# Altium schematic sheet bms_slave.SchDoc: bms_slave
size 580 x 453 mm; Date: 22/08/2017 2:36:35 p.m.; SheetNumber: 1
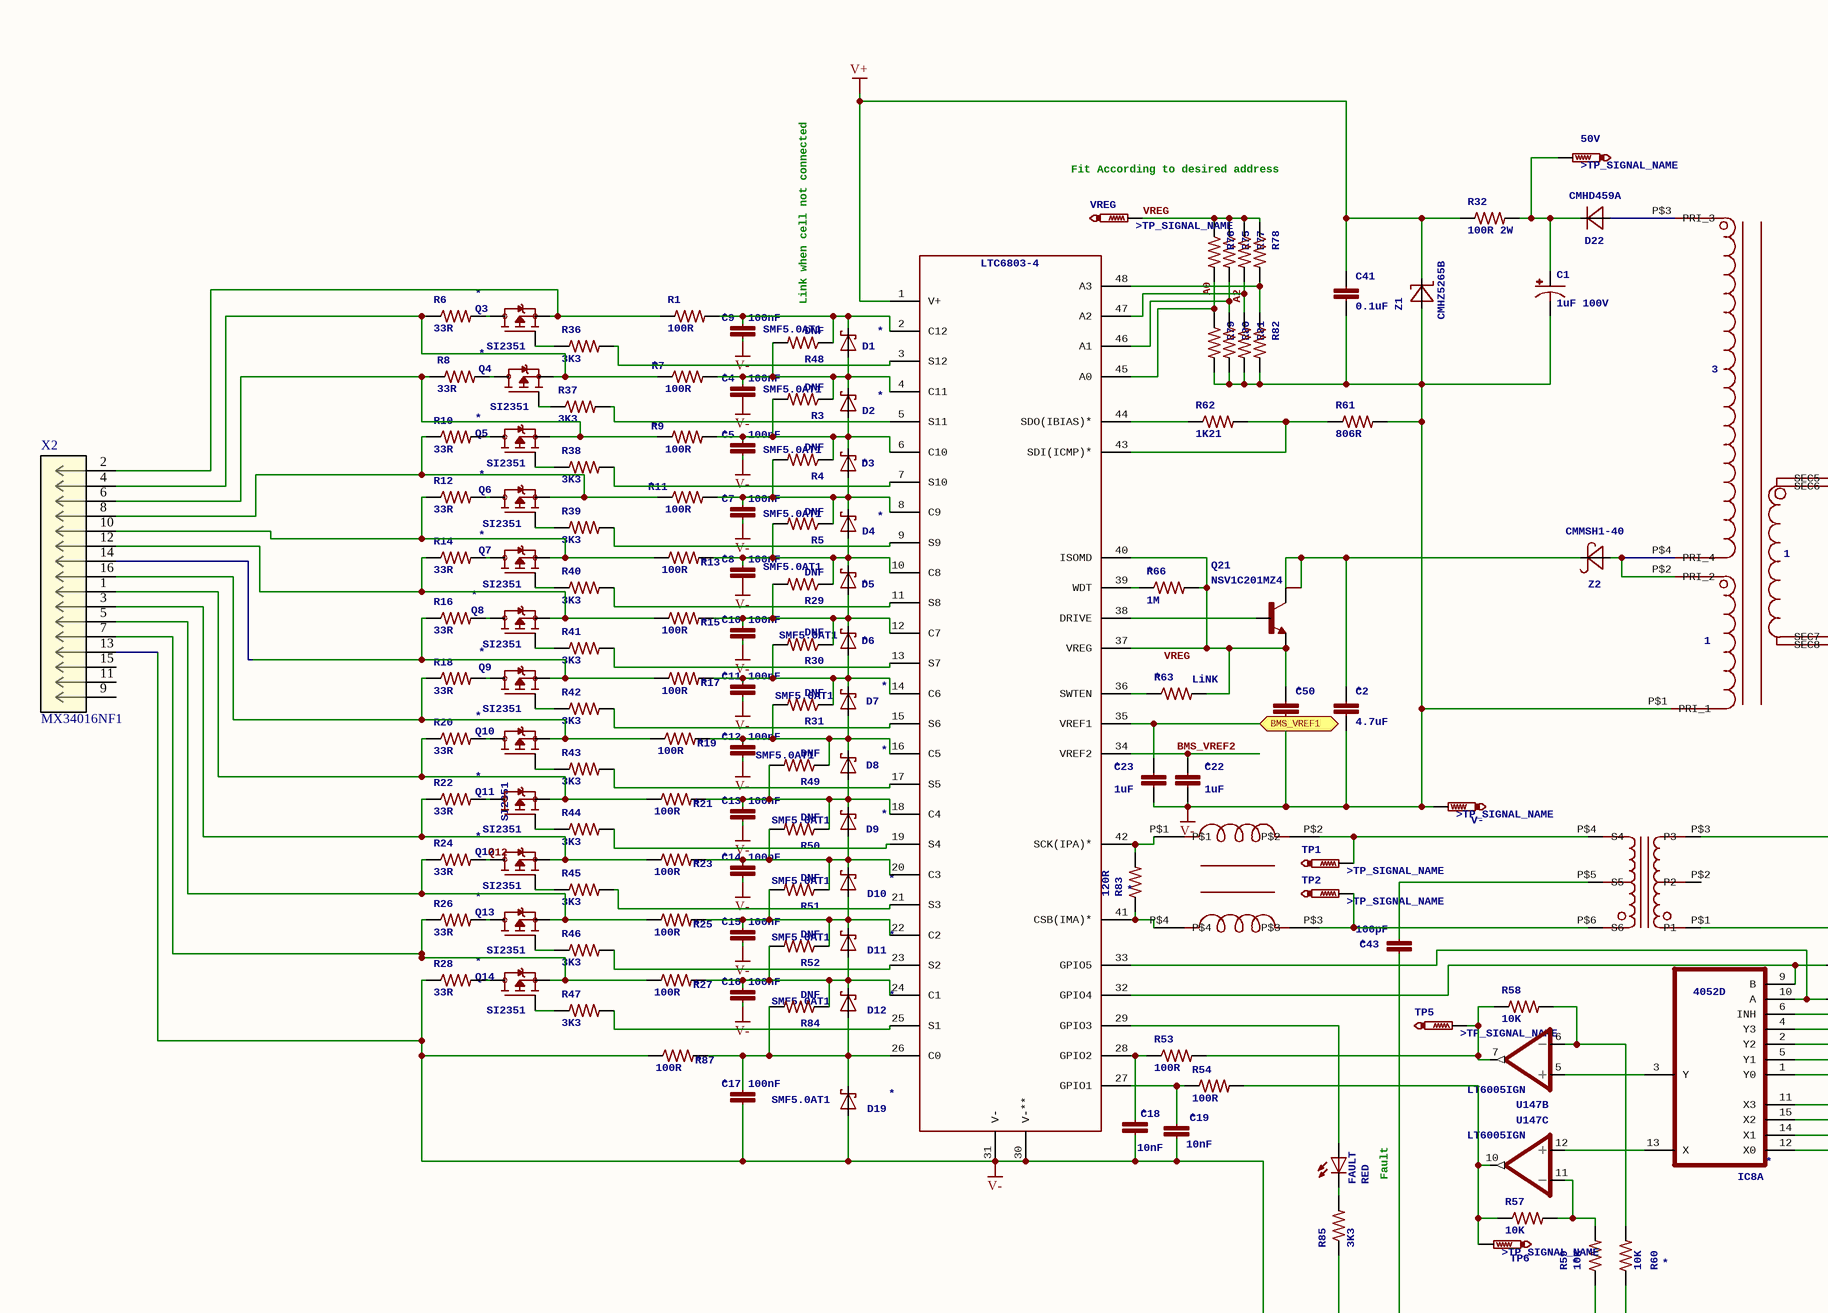
[diagram p0: bms_slave.SchDoc, top left]
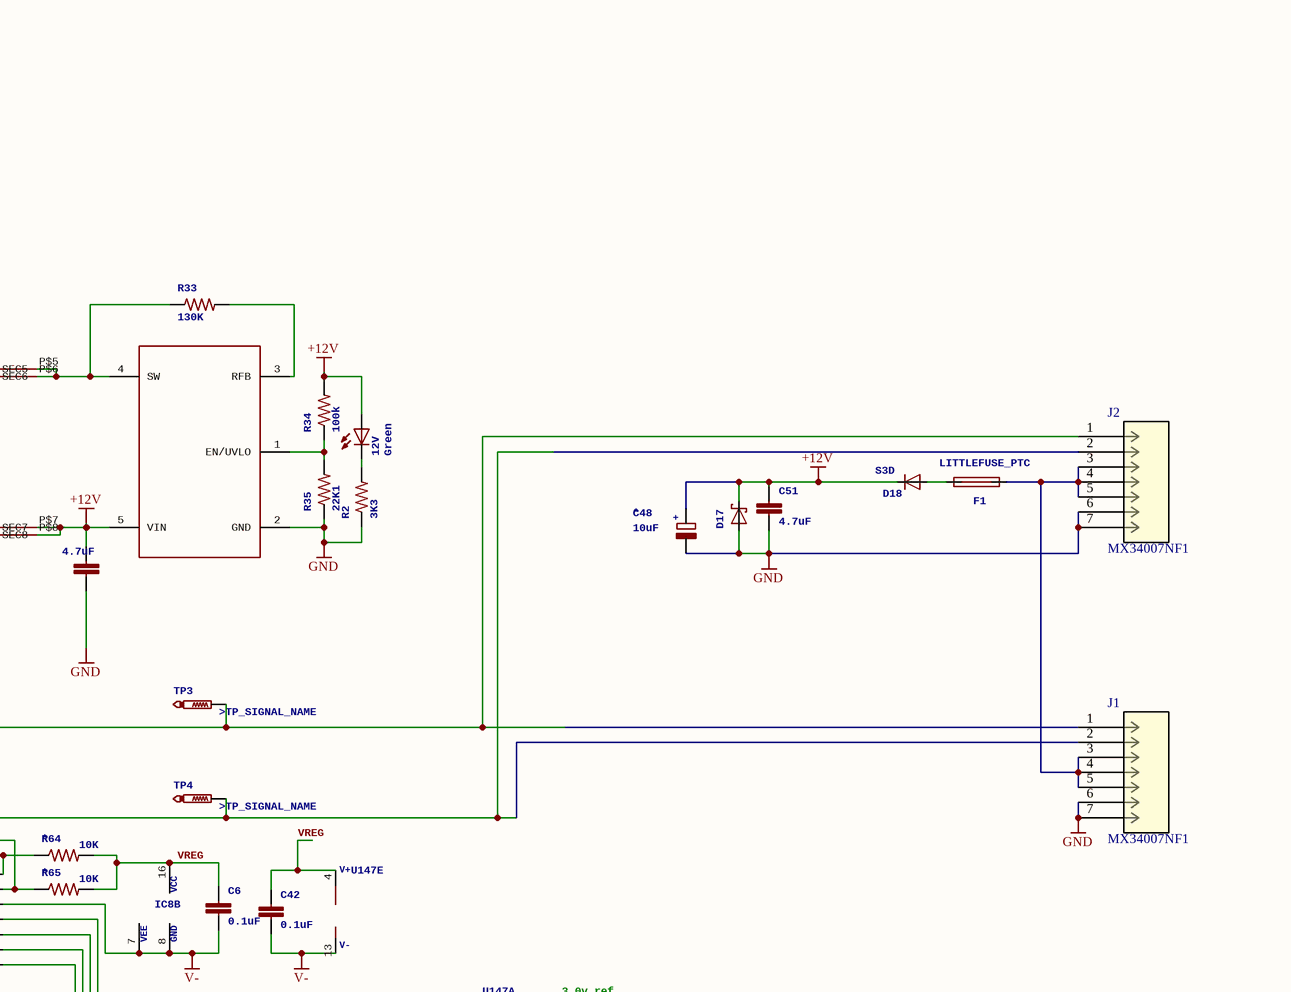
[diagram p1: bms_slave.SchDoc, top right]
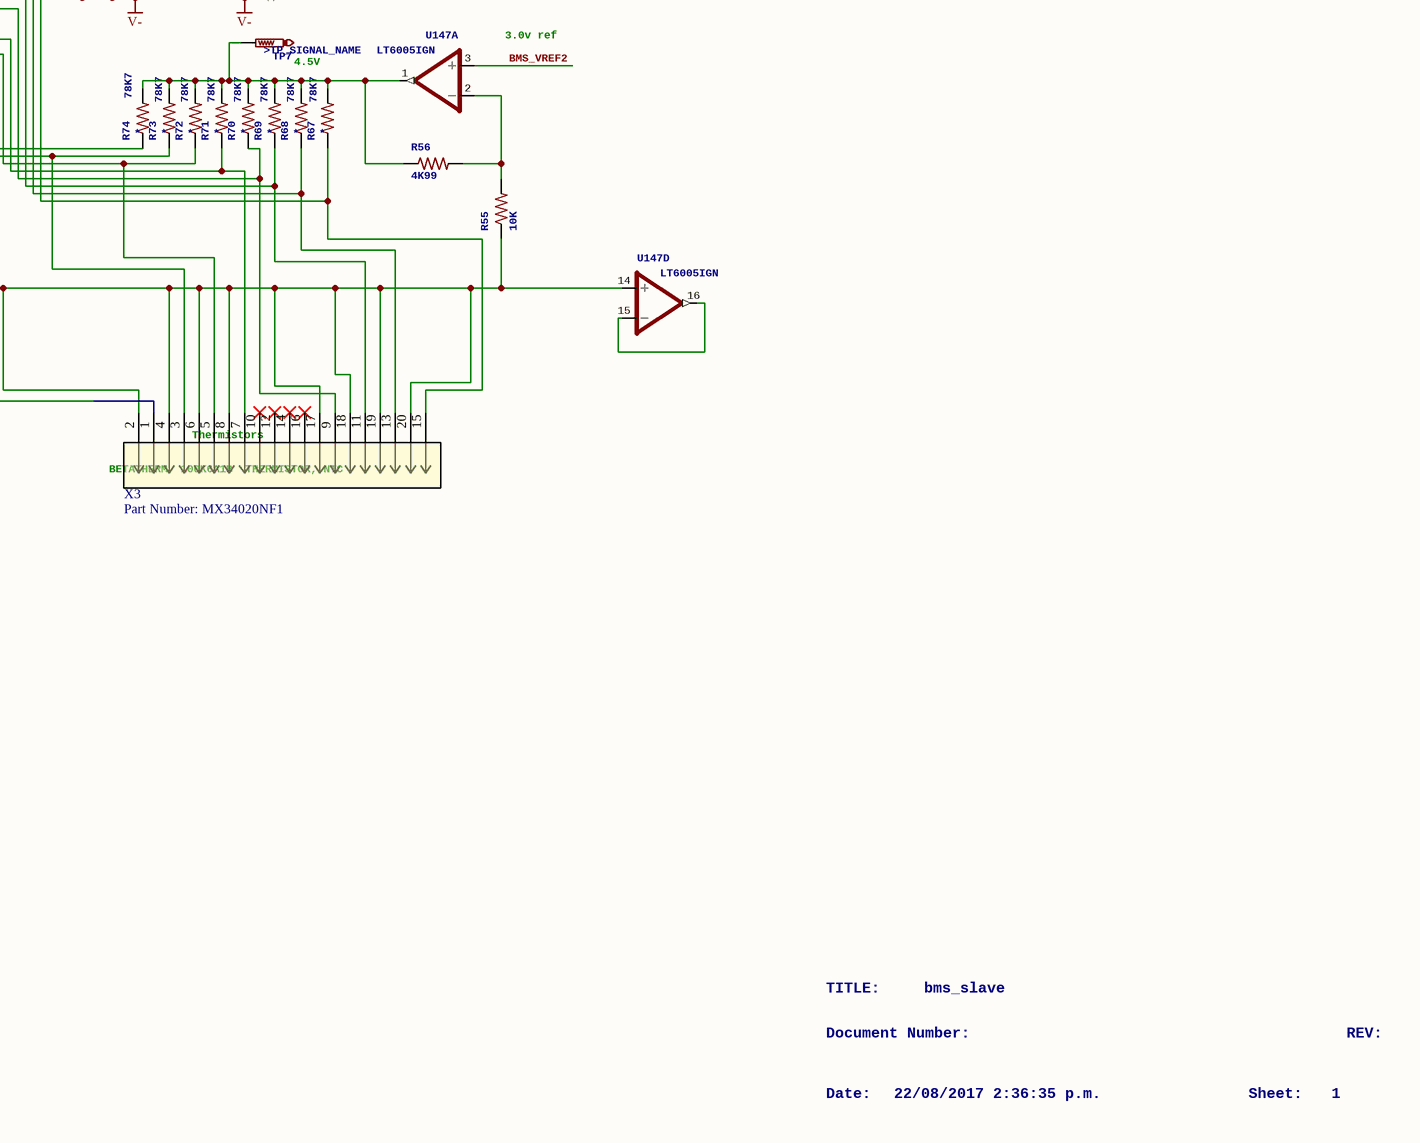
[diagram p2: bms_slave.SchDoc, bottom right]

## Parts
12V  Green  [CHIP-LED0805]
50V  TP_SIGNAL_NAME: >TP_SIGNAL_NAME  [P1-13]  (hidden comment: PTR1PAD1-13)
C1  1uF 100V  [SMC_D]
C2  4.7uF  [C1206]
C3  4.7uF  [C1206]
C4  100nF  [C0603@1]
C5  100nF  [C0603@1]
C6  0.1uF  [C1206]
C7  100nF  [C0603@1]
C8  100nF  [C0603@1]
C9  100nF  [C0603@1]
C10  100nF  [C0603@1]
C11  100nF  [C0603@1]
C12  100nF  [C0603@1]
C13  100nF  [C0603@1]
C14  100nF  [C0603@1]
C15  100nF  [C0603@1]
C16  100nF  [C0603@1]
C17  100nF  [C0603@1]
C18  10nF  [C0603@1]
C19  10nF  [C0603@1]
C22  1uF  [C1206]
C23  1uF  [C1206]
C41  0.1uF  [C1206]
C42  0.1uF  [C1206]
C43  100pF  [C1206@1]
C48  10uF  [SMC_D]
C50  1uF  [C1206]
C51  4.7uF  [C1206]
D1  SMF5.0AT1  [SOD123FL]
D2  SMF5.0AT1  [SOD123FL]
D3  SMF5.0AT1  [SOD123FL]
D4  SMF5.0AT1  [SOD123FL]
D5  SMF5.0AT1  [SOD123FL]
D6  SMF5.0AT1  [SOD123FL]
D7  SMF5.0AT1  [SOD123FL]
D8  SMF5.0AT1  [SOD123FL]
D9  SMF5.0AT1  [SOD123FL]
D10  SMF5.0AT1  [SOD123FL]
D11  SMF5.0AT1  [SOD123FL]
D12  SMF5.0AT1  [SOD123FL]
D17  SCHOTTKY-DIODESMC  [SMC]  (value not drawn)
D18  S3D  [SMC]
D19  SMF5.0AT1  [SOD123FL]
D22  CMHD459A  [SOD123]
F1  LITTLEFUSE_PTC  [1812]
FAULT  RED  [CHIP-LED0805]
IC8  4052D  [SO16]  (parts A,B of 2)
J1  MX34007NF1  [CONN_MX34007NF1]
J2  MX34007NF1  [CONN_MX34007NF1]
Q3  SI2351  [SOT23]
Q4  SI2351  [SOT23]
Q5  SI2351  [SOT23]
Q6  SI2351  [SOT23]
Q7  SI2351  [SOT23]
Q8  SI2351  [SOT23]
Q9  SI2351  [SOT23]
Q10  SI2351  [SOT23]
Q11  SI2351  [SOT23]
Q12  SI2351  [SOT23]
Q13  SI2351  [SOT23]
Q14  SI2351  [SOT23]
Q21  NSV1C201MZ4  [SOT223]
R1  100R  [R0603]
R2  3K3  [R0603]
R3  DNF  [R0603]
R4  DNF  [R0603]
R5  DNF  [R0603]
R6  33R  [R2512]
R7  100R  [R0603]
R8  33R  [R2512]
R9  100R  [R0603]
R10  33R  [R2512]
R11  100R  [R0603]
R12  33R  [R2512]
R13  100R  [R0603]
R14  33R  [R2512]
R15  100R  [R0603]
R16  33R  [R2512]
R17  100R  [R0603]
R18  33R  [R2512]
R19  100R  [R0603]
R20  33R  [R2512]
R21  100R  [R0603]
R22  33R  [R2512]
R23  100R  [R0603]
R24  33R  [R2512]
R25  100R  [R0603]
R26  33R  [R2512]
R27  100R  [R0603]
R28  33R  [R2512]
R29  DNF  [R0603]
R30  DNF  [R0603]
R31  DNF  [R0603]
R32  100R 2W  [R2512]
R33  130K  [R0603]
R34  100k  [R0603]
R35  22K1  [R0603]
R36  3K3  [R0603]
R37  3K3  [R0603]
R38  3K3  [R0603]
R39  3K3  [R0603]
R40  3K3  [R0603]
R41  3K3  [R0603]
R42  3K3  [R0603]
R43  3K3  [R0603]
R44  3K3  [R0603]
R45  3K3  [R0603]
R46  3K3  [R0603]
R47  3K3  [R0603]
R48  DNF  [R0603]
R49  DNF  [R0603]
R50  DNF  [R0603]
R51  DNF  [R0603]
R52  DNF  [R0603]
R53  100R  [R0603]
R54  100R  [R0603]
R55  10K  [R0603]
R56  4K99  [R0603]
R57  10K  [R0603]
R58  10K  [R0603]
R59  10K  [R0603]
R60  10K  [R0603]
R61  806R  [R0603]
R62  1K21  [R0603]
R63  LiNK  [R0603]
R64  10K  [R0603]
R65  10K  [R0603]
R66  1M  [R0603]
R67  78K7  [R0603]
R68  78K7  [R0603]
R69  78K7  [R0603]
R70  78K7  [R0603]
R71  78K7  [R0603]
R72  78K7  [R0603]
R73  78K7  [R0603]
R74  78K7  [R0603]
R75  R-US_R0603  [R0603]  (value not drawn)
R76  R-US_R0603  [R0603]  (value not drawn)
R77  R-US_R0603  [R0603]  (value not drawn)
R78  R-US_R0603  [R0603]  (value not drawn)
R79  R-US_R0603  [R0603]  (value not drawn)
R80  R-US_R0603  [R0603]  (value not drawn)
R81  R-US_R0603  [R0603]  (value not drawn)
R82  R-US_R0603  [R0603]  (value not drawn)
R83  120R  [R0603]
R84  DNF  [R0603]
R85  3K3  [R0603]
R87  100R  [R0603]
TP1  TP_SIGNAL_NAME: >TP_SIGNAL_NAME  [P1-13]  (hidden comment: PTR1PAD1-13)
TP2  TP_SIGNAL_NAME: >TP_SIGNAL_NAME  [P1-13]  (hidden comment: PTR1PAD1-13)
TP3  TP_SIGNAL_NAME: >TP_SIGNAL_NAME  [P1-13]  (hidden comment: PTR1PAD1-13)
TP4  TP_SIGNAL_NAME: >TP_SIGNAL_NAME  [P1-13]  (hidden comment: PTR1PAD1-13)
TP5  TP_SIGNAL_NAME: >TP_SIGNAL_NAME  [P1-13]  (hidden comment: PTR1PAD1-13)
TP6  TP_SIGNAL_NAME: >TP_SIGNAL_NAME  [P1-13]  (hidden comment: PTR1PAD1-13)
TP7  TP_SIGNAL_NAME: >TP_SIGNAL_NAME  [P1-13]  (hidden comment: PTR1PAD1-13)
U1  LTC6804-2  [SSOP48]  (value not drawn)
U21  LT8300  [TSOT23-5]  (value not drawn)
U147  LT6005IGN  [TSSOP16]  (parts A,B,C,D,E of 7)
U$1  DLW43SH510XK2  [DLW43S]  (value not drawn)
U$3  T3001NL  [T3001NL]  (value not drawn)
U$15  WURTH_750370040  [WE_750370040]  (value not drawn)
V-  TP_SIGNAL_NAME: >TP_SIGNAL_NAME  [P1-13]  (hidden comment: PTR1PAD1-13)
VREG  TP_SIGNAL_NAME: >TP_SIGNAL_NAME  [P1-13]  (hidden comment: PTR1PAD1-13)
X2  MX34016NF1
X3  Part Number: MX34020NF1  [CONN_MX34020NF1]
Z1  CMHZ5265B  [SOD123]
Z2  CMMSH1-40  [SOD123]

## Ports
BMS_VREF1

## Nets
+12V: 12V.A C3.1 C48.+ C51.1 D17.C D18.C R34.2 U21.5(VIN) U$15.P$7(SEC7) U$15.P$8(SEC8)
GND: C3.2 C48.- C51.2 D17.A J1.6 J1.7 J2.6 J2.7 R2.1 R35.1 U21.2(GND)
V+: C41.1 R32.1 U1.1(V+) Z1.C
V-: C1.- C2.2 C4.2 C5.2 C6.2 C7.2 C8.2 C9.2 C10.2 C11.2 C12.2 C13.2 C14.2 C15.2 C16.2 C17.2 C18.2 C19.2 C22.2 C23.2 C41.2 C42.2 C43.2 C50.2 D19.A IC8.6(INH) IC8.7(VEE) IC8.8(GND) R28.1 R55.1 R59.1 R60.1 R61.2 R79.2 R80.2 R81.2 R82.2 R85.1 R87.1 U1.30(V-**) U1.31(V-) U147.13(V-) U147.14(+IN) U$15.P$1(PRI_1) V-.TP X2.13 X3.2 X3.4 X3.6 X3.8 X3.17 X3.18 X3.19 X3.20 Z1.A
A0: R76.2 R79.1 U1.45(A0)
A2: R77.2 R81.1 U1.47(A2)
BMS_VREF1: C23.1 U1.35(VREF1) ; port BMS_VREF1
BMS_VREF2: C22.1 U1.34(VREF2) U147.3(+IN)
Q12: Q12.3(D) R24.2
VREG: C6.1 C42.1 C50.1 IC8.16(VCC) Q21.3(E) R63.2 R64.2 R65.2 R66.2 R75.1 R76.1 R77.1 R78.1 U1.37(VREG) U1.40(ISOMD) U147.4(V+) VREG.TP
Net12V_C: 12V.C R2.2
Net50V_TP: 50V.TP C1.+ D22.C R32.2
NetC2_1: C2.1 Q21.2(C2) Q21.4(C4) Z2.C
NetC4_1: C4.1 D1.A D2.C R3.1 R7.2 R48.2 U1.4(C11)
NetC5_1: C5.1 D2.A D3.C R3.2 R4.1 R9.2 U1.6(C10)
NetC7_1: C7.1 D3.A D4.C R4.2 R5.1 R11.2 U1.8(C9)
NetC8_1: C8.1 D4.A D5.C R5.2 R13.2 R29.1 U1.10(C8)
NetC9_1: C9.1 D1.C R1.2 R48.1 U1.2(C12)
NetC10_1: C10.1 D5.A D6.C R15.2 R29.2 R30.1 U1.12(C7)
NetC11_1: C11.1 D6.A D7.C R17.2 R30.2 R31.1 U1.14(C6)
NetC12_1: C12.1 D7.A D8.C R19.2 R31.2 R49.1 U1.16(C5)
NetC13_1: C13.1 D8.A D9.C R21.2 R49.2 R50.1 U1.18(C4)
NetC14_1: C14.1 D9.A D10.C R23.2 R50.2 R51.1 U1.20(C3)
NetC15_1: C15.1 D10.A D11.C R25.2 R51.2 R52.1 U1.22(C2)
NetC16_1: C16.1 D11.A D12.C R27.2 R52.2 R84.1 U1.24(C1)
NetC17_1: C17.1 D12.A D19.C R84.2 R87.2 U1.26(C0)
NetC18_1: C18.1 R53.1 U1.28(GPIO2)
NetC19_1: C19.1 R54.1 U1.27(GPIO1)
NetC43_1: C43.1 U$3.P$5(S5)
NetD18_A: D18.A F1.P$2
NetD22_A: D22.A U$15.P$3(PRI_3)
NetF1_P$1: F1.P$1 J1.3 J1.4 J1.5 J2.3 J2.4 J2.5
NetFAULT_A: FAULT.A U1.29(GPIO3)
NetFAULT_C: FAULT.C R85.2
NetIC8_1: IC8.1(Y0) R70.1 X3.9
NetIC8_2: IC8.2(Y2) R68.1 X3.13
NetIC8_3: IC8.3(Y) U147.5(+IN)
NetIC8_4: IC8.4(Y3) R67.1 X3.15
NetIC8_5: IC8.5(Y1) R69.1 X3.11
NetIC8_9: IC8.9(B) R64.1 U1.32(GPIO4)
NetIC8_10: IC8.10(A) R65.1 U1.33(GPIO5)
NetIC8_11: IC8.11(X3) R71.1 X3.7
NetIC8_12: IC8.12(X0) R74.1 X3.1
NetIC8_13: IC8.13(X) U147.12(+IN)
NetIC8_14: IC8.14(X1) R73.1 X3.3
NetIC8_15: IC8.15(X2) R72.1 X3.5
NetJ1_1: J1.1 J2.1 TP3.TP U$3.P$3(P3)
NetJ1_2: J1.2 J2.2 TP4.TP U$3.P$1(P1)
NetQ3_1: Q3.1(G) R36.1
NetQ3_2: Q3.2(S) R1.1 X2.2
NetQ3_3: Q3.3(D) R6.2
NetQ4_1: Q4.1(G) R37.1
NetQ4_2: Q4.2(S) R6.1 R7.1 X2.4
NetQ4_3: Q4.3(D) R8.2
NetQ5_1: Q5.1(G) R38.1
NetQ5_2: Q5.2(S) R8.1 R9.1 X2.6
NetQ5_3: Q5.3(D) R10.2
NetQ6_1: Q6.1(G) R39.1
NetQ6_2: Q6.2(S) R10.1 R11.1 X2.8
NetQ6_3: Q6.3(D) R12.2
NetQ7_1: Q7.1(G) R40.1
NetQ7_2: Q7.2(S) R12.1 R13.1 X2.10
NetQ7_3: Q7.3(D) R14.2
NetQ8_1: Q8.1(G) R41.1
NetQ8_2: Q8.2(S) R14.1 R15.1 X2.12
NetQ8_3: Q8.3(D) R16.2
NetQ9_1: Q9.1(G) R42.1
NetQ9_2: Q9.2(S) R16.1 R17.1 X2.14
NetQ9_3: Q9.3(D) R18.2
NetQ10_1: Q10.1(G) R43.1
NetQ10_2: Q10.2(S) R18.1 R19.1 X2.16
NetQ10_3: Q10.3(D) R20.2
NetQ11_1: Q11.1(G) R44.1
NetQ11_2: Q11.2(S) R20.1 R21.1 X2.1
NetQ11_3: Q11.3(D) R22.2
NetQ12_1: Q12.1(G) R45.1
NetQ12_2: Q12.2(S) R22.1 R23.1 X2.3
NetQ13_1: Q13.1(G) R46.1
NetQ13_2: Q13.2(S) R24.1 R25.1 X2.5
NetQ13_3: Q13.3(D) R26.2
NetQ14_1: Q14.1(G) R47.1
NetQ14_2: Q14.2(S) R26.1 R27.1 X2.7
NetQ14_3: Q14.3(D) R28.2
NetQ21_1: Q21.1(B) U1.38(DRIVE)
NetR33_1: R33.1 U21.4(SW) U$15.P$5(SEC5) U$15.P$6(SEC6)
NetR33_2: R33.2 U21.3(RFB)
NetR34_1: R34.1 R35.2 U21.1(EN/UVLO)
NetR36_2: R36.2 U1.3(S12)
NetR37_2: R37.2 U1.5(S11)
NetR38_2: R38.2 U1.7(S10)
NetR39_2: R39.2 U1.9(S9)
NetR40_2: R40.2 U1.11(S8)
NetR41_2: R41.2 U1.13(S7)
NetR42_2: R42.2 U1.15(S6)
NetR43_2: R43.2 U1.17(S5)
NetR44_2: R44.2 U1.19(S4)
NetR45_2: R45.2 U1.21(S3)
NetR46_2: R46.2 U1.23(S2)
NetR47_2: R47.2 U1.25(S1)
NetR53_2: R53.2 R58.1 TP5.TP U147.7(OUT)
NetR54_2: R54.2 R57.1 TP6.TP U147.10(OUT)
NetR55_2: R55.2 R56.2 U147.2(-IN)
NetR56_1: R56.1 R67.2 R68.2 R69.2 R70.2 R71.2 R72.2 R73.2 R74.2 TP7.TP U147.1(OUT)
NetR57_2: R57.2 R59.2 U147.11(-IN)
NetR58_2: R58.2 R60.2 U147.6(-IN)
NetR61_1: R61.1 R62.2 U1.43(SDI(ICMP)*)
NetR62_1: R62.1 U1.44(SDO(IBIAS)*)
NetR63_1: R63.1 U1.36(SWTEN)
NetR66_1: R66.1 U1.39(WDT)
NetR75_2: R75.2 R80.1 U1.46(A1)
NetR78_2: R78.2 R82.1 U1.48(A3)
NetR83_1: R83.1 U1.41(CSB(IMA)*) U$1.P$4
NetR83_2: R83.2 U1.42(SCK(IPA)*) U$1.P$1
NetTP1_TP: TP1.TP U$1.P$2 U$3.P$4(S4)
NetTP2_TP: TP2.TP U$1.P$3 U$3.P$6(S6)
NetU147_15: U147.15(-IN) U147.16(OUT)
NetU$15_P$2: U$15.P$2(PRI_2) U$15.P$4(PRI_4) Z2.A

Not connected (* = marked no-connect by the designer): U$3 P$2(P2); X2 9 11 15; X3 10* 12* 14* 16*

## Notes on the sheet
- Fit According to desired address
- Link when cell not connected
- (near U147) 3.0v ref
- Fault
- 4.5V
- (near X3) BETATHERM  100K6A1B  THERMISTOR, NTC
- (near X3) Thermistors
- TITLE:
- Document Number:
- bms_slave
- REV:
- Date:
- 22/08/2017 2:36:35 p.m.
- Sheet:
- 1
- 2
- 3
- 4
- 5
- 6
- 7
- 8
- 9
- 10
- 11
- A
- B
- C
- D
- E
- F
- G
- H
- I

## Library data of the parts
12V FAULT = LEDCHIP-LED0805: LED   OSRAM: - CHIPLED LG R971, LG N971, LY N971, LG Q971, LY Q971, LO R971, LY R971 LH N974, LH R974 LS Q976, LO Q976, LY Q976 LO Q996 - Hyper CHIPLED LW Q18S LB Q993, LB Q99A, LB R99A - SideLED LS A670, LO A670, LY A670, LG A670, LP A670 LB A673, LV A673, LT A673, LW A673 LH A674 LY A675 LS A676, LA A676, LO A676, LY A676, LW A676 LS A679, LY A679, LG A679 -  Hyper Micro SIDELEDÂ® LS Y876, LA Y876, LO Y876, LY Y876 LT Y87S - SmartLED LW L88C, LW L88S LB L89C, LB L89S, LG L890 LS L89K, LO L89K, LY L89K LS L896, LA L896, LO L896, LY L896 - TOPLED LS T670, LO T670, LY T670, LG T670, LP T670 LSG T670, LSP T670, LSY T670, LOP T670, LYG T670 LG T671, LOG T671, LSG T671 LB T673, LV T673, LT T673, LW T673 LH T674 LS T676, LA T676, LO T676, LY T676, LB T676, LH T676, LSB T676, LW T676 LB T67C, LV T67C, LT T67C, LS T67K, LO T67K, LY T67K, LW E67C LS E67B, LA E67B, LO E67B, LY E67B, LB E67C, LV E67C, LT E67C LW T67C LS T679, LY T679, LG T679 LS T770, LO T770, LY T770, LG T770, LP T770 LB T773, LV T773, LT T773, LW T773 LH T774 LS E675, LA E675, LY E675, LS T675 LS T776, LA T776, LO T776, LY T776, LB T776 LHGB T686 LT T68C, LB T68C - Hyper Mini TOPLEDÂ® LB M676 - Mini TOPLED SantanaÂ® LG M470 LS M47K, LO M47K, LY M47K    Source: http://www.osram.convergy.de   LUXEON: - LUMILEDÂ® LXK2-PW12-R00, LXK2-PW12-S00, LXK2-PW14-U00, LXK2-PW14-V00 LXK2-PM12-R00, LXK2-PM12-S00, LXK2-PM14-U00 LXK2-PE12-Q00, LXK2-PE12-R00, LXK2-PE12-S00, LXK2-PE14-T00, LXK2-PE14-U00 LXK2-PB12-K00, LXK2-PB12-L00, LXK2-PB12-M00, LXK2-PB14-N00, LXK2-PB14-P00, LXK2-PB14-Q00 LXK2-PR12-L00, LXK2-PR12-M00, LXK2-PR14-Q00, LXK2-PR14-R00 LXK2-PD12-Q00, LXK2-PD12-R00, LXK2-PD12-S00 LXK2-PH12-R00, LXK2-PH12-S00 LXK2-PL12-P00, LXK2-PL12-Q00, LXK2-PL12-R00    Source: www.luxeon.com   KINGBRIGHT:   KA-3528ASYC Source: www.kingbright.com
50V TP1-TP7 V- VREG = PTR1PAD1-13: TEST PIN
C1 = CPOL-USSMCD: POLARIZED CAPACITOR, American symbol
C2 C3 C6 C22 C23 C41 C42 C50 C51 = C-EUC1206: CAPACITOR, European symbol
  C2 C22 C23 C50: NAME: *
C4 C5 C7-C19 = C-EU-SMALL_0603: NAME: *
C43 = C-EU-SMALL: NAME: *
C48 = CPOL-EUSMCD: POLARIZED CAPACITOR, European symbol; NAME: *; +: +
D1-D12 D19 = SMF5.0AT1: 200 W Transient Voltage Suppressor   Source: Data sheet; NAME: *
D17 = SCHOTTKY-DIODESMC: Schottky Diode
D18 = DIODE-SMC: DIODE
IC8 = 4052D: Dual 4-channel ANALOG MULTIPLEXER; NAME: *
R1-R5 R7 R9 R11 R13 R15 R17 R19 R21 R23 R25 R27 R29-R31 R33-R85 R87 = R-US_R0603: RESISTOR, American symbol
  R7 R9 R11 R13 R15 R17 R19 R21 R23 R25 R27 R59 R60 R63-R74 R83 R87: NAME: *
R6 R8 R10 R12 R14 R16 R18 R20 R22 R24 R26 R28 R32 = R-US_R2512: RESISTOR, American symbol
X3 = MX34020NF1: No Description Available; Vendor: JAE Electronics; Built_By: EMA_Cory; Manufacturer_Part_Number: MX34020NF1; Copyright: Copyright (C) 2018 Accelerated Designs. All rights reserved; RefDes: RefDes; Type: DEV; Value: Value
Q3-Q14 = SI2351: NAME: *
U1 = LTC6804-2: LTC6803-4: LTC6803-4
U$15 = WURTH_750370040: 1: 1; 3: 3